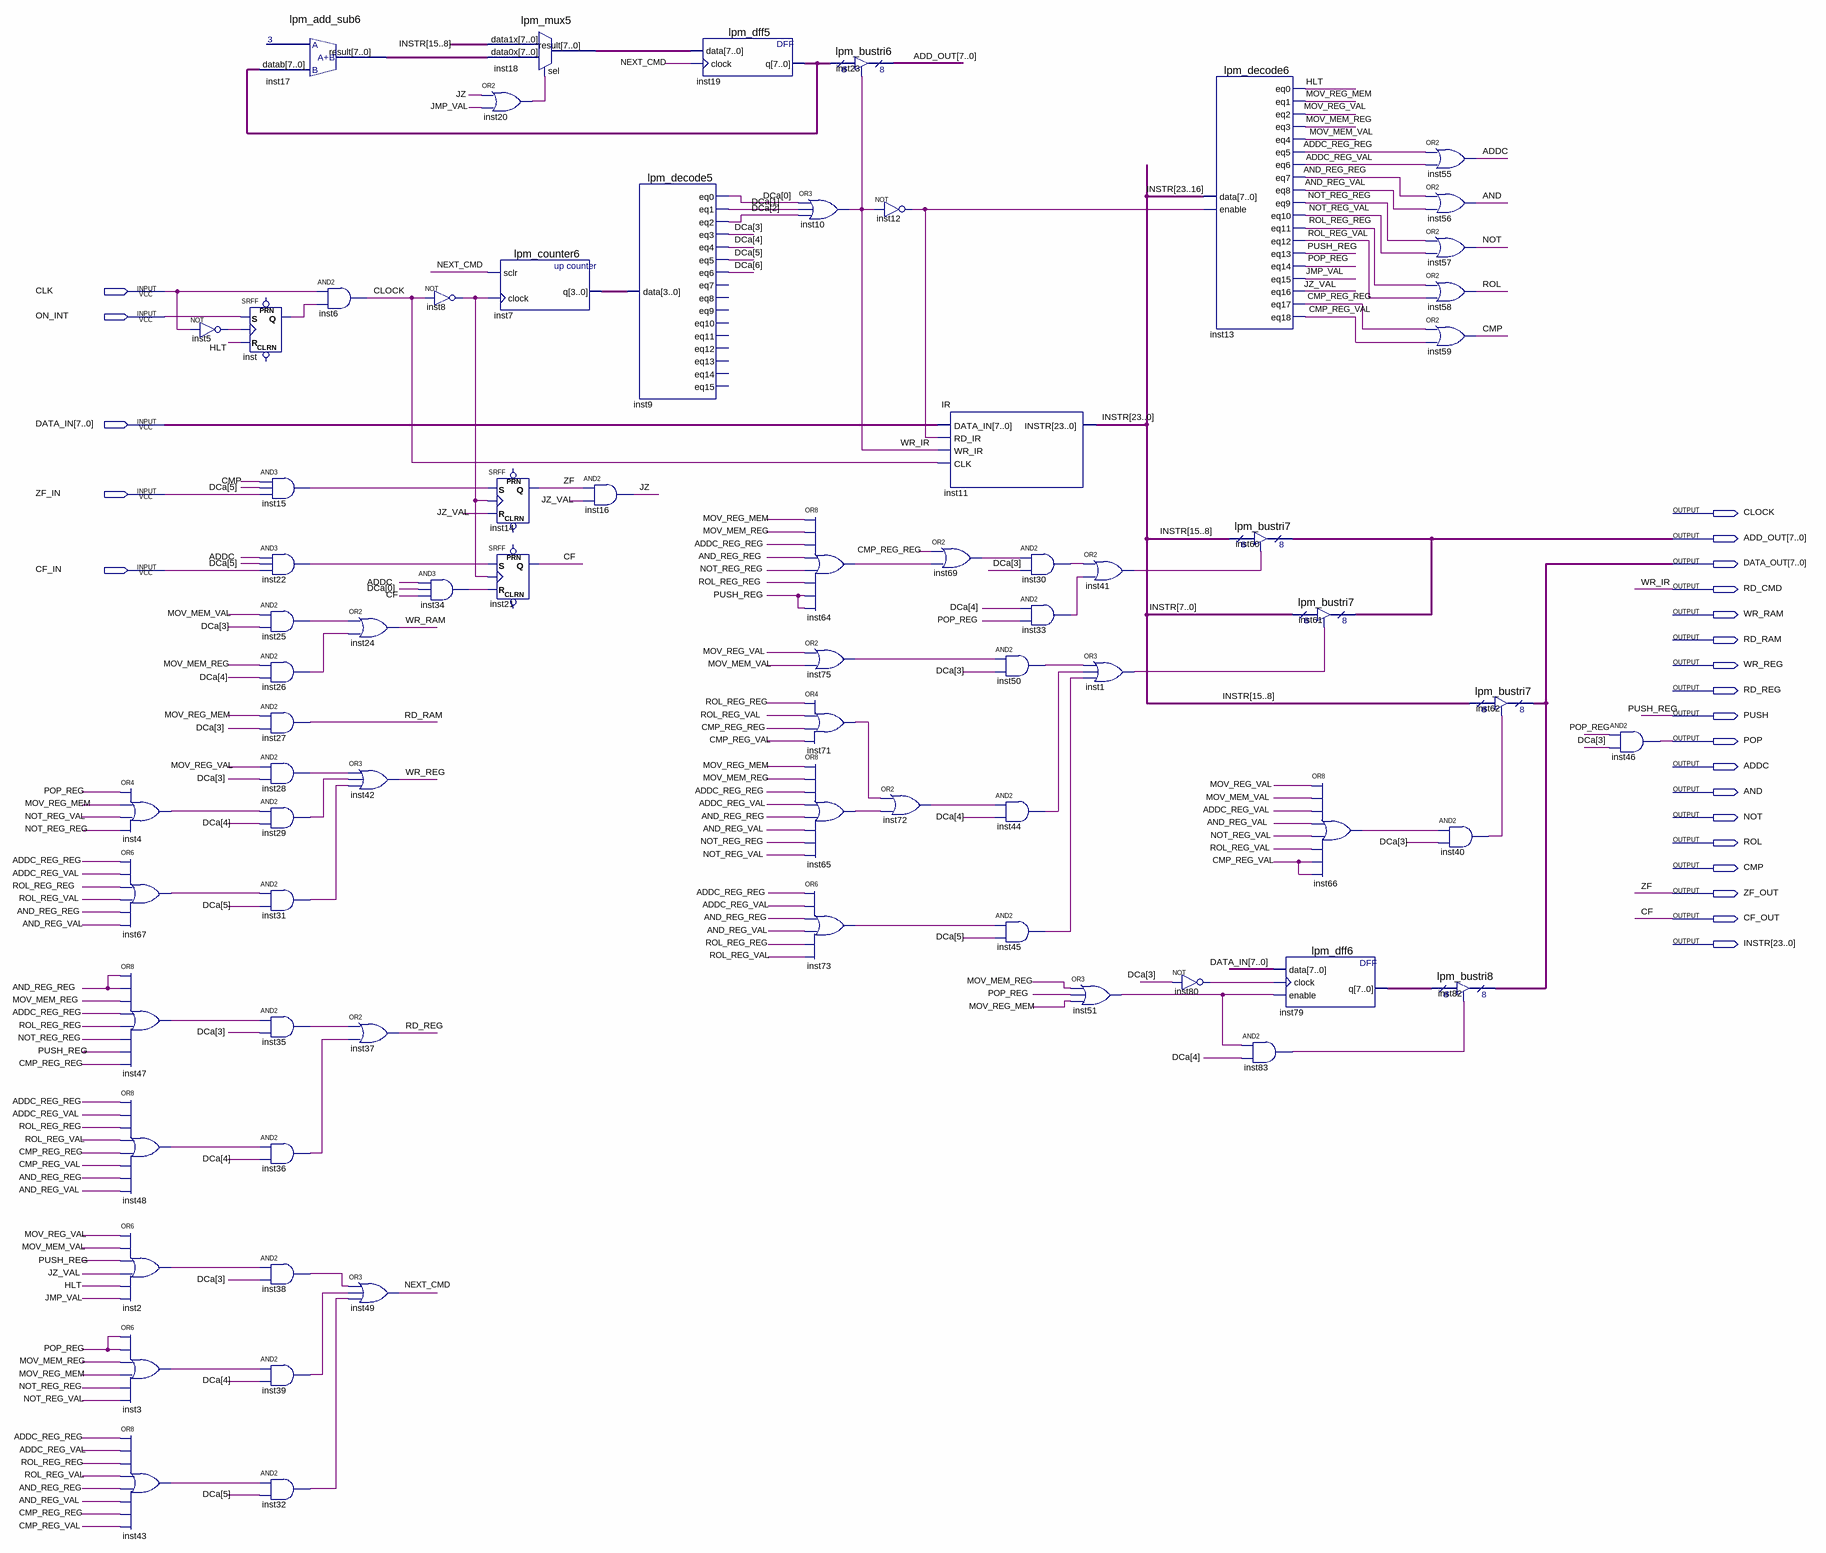
[diagram p0: schematic sheet]
// Quartus schematic CU.bdf as structural Verilog: 73 symbols, 23 pins
module CU (
  input  CLK,
  input  ON_INT,
  input  [7:0] DATA_IN,
  input  ZF_IN,
  input  CF_IN,
  output CLOCK,
  output [7:0] ADD_OUT,
  output [7:0] DATA_OUT,
  output RD_CMD,
  output WR_RAM,
  output RD_RAM,
  output WR_REG,
  output RD_REG,
  output PUSH,
  output POP,
  output ADDC,
  output AND,
  output NOT,
  output ROL,
  output CMP,
  output ZF_OUT,
  output CF_OUT,
  output [23:0] INSTR
);

  wire ADDC_REG_REG, ADDC_REG_VAL, AND_REG_REG, AND_REG_VAL, CMP_REG_REG, CMP_REG_VAL, HLT, inst1_out,
       inst2_out, inst3_out, inst4_out, inst5_out, inst8_out, inst12_out, inst15_out, inst20_out, inst22_out,
       inst25_out, inst26_out, inst28_out, inst29_out, inst30_out, inst31_out, inst32_out, inst33_out,
       inst34_out, inst35_out, inst36_out, inst38_out, inst39_out, inst40_out, inst41_out, inst43_out,
       inst44_out, inst45_out, inst47_out, inst48_out, inst50_out, inst51_out, inst64_out, inst65_out,
       inst66_out, inst67_out, inst69_out, inst71_out, inst72_out, inst73_out, inst75_out, inst80_out,
       inst83_out, inst_q, JMP_VAL, JZ, JZ_VAL, MOV_MEM_REG, MOV_MEM_VAL, MOV_REG_MEM, MOV_REG_VAL, NEXT_CMD,
       NOT_REG_REG, NOT_REG_VAL, POP_REG, ROL_REG_REG, ROL_REG_VAL;
  wire [3:0] inst7_q;
  wire [6:0] DCa;
  wire [7:0] inst17_result, inst18_result, inst19_q, inst79_q;

  or inst4 (inst4_out, POP_REG, MOV_REG_MEM, NOT_REG_VAL, NOT_REG_REG);
  or inst67 (inst67_out, ADDC_REG_REG, ADDC_REG_VAL, ROL_REG_REG, ROL_REG_VAL, AND_REG_REG, AND_REG_VAL);
  or inst47 (inst47_out, AND_REG_REG, AND_REG_REG, MOV_MEM_REG, ADDC_REG_REG, ROL_REG_REG, NOT_REG_REG, PUSH, CMP_REG_REG);
  or inst48 (inst48_out, ADDC_REG_REG, ADDC_REG_VAL, ROL_REG_REG, ROL_REG_VAL, CMP_REG_REG, CMP_REG_VAL, AND_REG_REG, AND_REG_VAL);
  or inst2 (inst2_out, MOV_REG_VAL, MOV_MEM_VAL, PUSH, JZ_VAL, HLT, JMP_VAL);
  or inst3 (inst3_out, POP_REG, POP_REG, MOV_MEM_REG, MOV_REG_MEM, NOT_REG_REG, NOT_REG_VAL);
  or inst43 (inst43_out, ADDC_REG_REG, ADDC_REG_VAL, ROL_REG_REG, ROL_REG_VAL, AND_REG_REG, AND_REG_VAL, CMP_REG_REG, CMP_REG_VAL);
  not inst5 (inst5_out, CLK);
  SRFF inst (.S(ON_INT), .R(HLT), .CLK(inst5_out), .Q(inst_q));  // open: PRN, CLRN
  lpm_add_sub6 inst17 (.datab(inst19_q), .result(inst17_result));
  and inst15 (inst15_out, CMP, DCa[5], ZF_IN);
  and inst22 (inst22_out, ADDC, DCa[5], CF_IN);
  and inst25 (inst25_out, MOV_MEM_VAL, DCa[3]);
  and inst26 (inst26_out, MOV_MEM_REG, DCa[4]);
  and inst27 (RD_RAM, MOV_REG_MEM, DCa[3]);
  and inst28 (inst28_out, MOV_REG_VAL, DCa[3]);
  and inst29 (inst29_out, inst4_out, DCa[4]);
  and inst31 (inst31_out, inst67_out, DCa[5]);
  and inst35 (inst35_out, inst47_out, DCa[3]);
  and inst36 (inst36_out, inst48_out, DCa[4]);
  and inst38 (inst38_out, inst2_out, DCa[3]);
  and inst39 (inst39_out, inst3_out, DCa[4]);
  and inst32 (inst32_out, inst43_out, DCa[5]);
  and inst6 (CLOCK, CLK, inst_q);
  or inst24 (WR_RAM, inst25_out, inst26_out);
  or inst42 (WR_REG, inst28_out, inst29_out, inst31_out);
  or inst37 (RD_REG, inst35_out, inst36_out);
  or inst49 (NEXT_CMD, inst38_out, inst39_out, inst32_out);
  not inst8 (inst8_out, CLOCK);
  and inst34 (inst34_out, ADDC, DCa[0], CF_OUT);
  lpm_mux5 inst18 (.data1x(INSTR[15:8]), .data0x(inst17_result), .sel(inst20_out), .result(inst18_result));
  or inst20 (inst20_out, JZ, JMP_VAL);
  lpm_counter6 inst7 (.sclr(NEXT_CMD), .clock(inst8_out), .q(inst7_q));
  SRFF inst14 (.S(inst15_out), .R(JZ_VAL), .CLK(inst8_out), .Q(ZF_OUT));  // open: PRN, CLRN
  SRFF inst21 (.S(inst22_out), .R(inst34_out), .CLK(inst8_out), .Q(CF_OUT));  // open: PRN, CLRN
  and inst16 (JZ, ZF_OUT, JZ_VAL);
  lpm_decode5 inst9 (
    .data(inst7_q), .eq0(DCa[0]), .eq1(DCa[1]), .eq2(DCa[2]), .eq3(DCa[3]), .eq4(DCa[4]), .eq5(DCa[5]),
    .eq6(DCa[6]));  // open: eq7, eq8, eq9, eq10, eq11, eq12, eq13, eq14, eq15
  lpm_dff5 inst19 (.data(inst18_result), .clock(NEXT_CMD), .q(inst19_q));
  or inst10 (RD_CMD, DCa[0], DCa[1], DCa[2]);
  lpm_bustri6 inst23 (.enabledt(RD_CMD), .data(inst19_q), .tridata(ADD_OUT));
  or inst64 (inst64_out, MOV_REG_MEM, MOV_MEM_REG, ADDC_REG_REG, AND_REG_REG, NOT_REG_REG, ROL_REG_REG, PUSH, PUSH);
  or inst75 (inst75_out, MOV_REG_VAL, MOV_MEM_VAL);
  or inst71 (inst71_out, ROL_REG_REG, ROL_REG_VAL, CMP_REG_REG, CMP_REG_VAL);
  or inst65 (inst65_out, MOV_REG_MEM, MOV_MEM_REG, ADDC_REG_REG, ADDC_REG_VAL, AND_REG_REG, AND_REG_VAL, NOT_REG_REG, NOT_REG_VAL);
  or inst73 (inst73_out, ADDC_REG_REG, ADDC_REG_VAL, AND_REG_REG, AND_REG_VAL, ROL_REG_REG, ROL_REG_VAL);
  not inst12 (inst12_out, RD_CMD);
  or inst72 (inst72_out, inst71_out, inst65_out);
  IR inst11 (.DATA_IN(DATA_IN), .RD_IR(inst12_out), .WR_IR(RD_CMD), .CLK(CLOCK), .INSTR(INSTR));
  or inst69 (inst69_out, CMP_REG_REG, inst64_out);
  and inst50 (inst50_out, inst75_out, DCa[3]);
  and inst44 (inst44_out, inst72_out, DCa[4]);
  and inst45 (inst45_out, inst73_out, DCa[5]);
  and inst30 (inst30_out, inst69_out, DCa[3]);
  and inst33 (inst33_out, DCa[4], POP_REG);
  or inst41 (inst41_out, inst30_out, inst33_out);
  or inst1 (inst1_out, inst50_out, inst44_out, inst45_out);
  or inst51 (inst51_out, MOV_MEM_REG, POP_REG, MOV_REG_MEM);
  lpm_decode6 inst13 (
    .data(INSTR[23:16]), .enable(inst12_out), .eq0(HLT), .eq1(MOV_REG_MEM), .eq2(MOV_REG_VAL),
    .eq3(MOV_MEM_REG), .eq4(MOV_MEM_VAL), .eq5(ADDC_REG_REG), .eq6(ADDC_REG_VAL), .eq7(AND_REG_REG),
    .eq8(AND_REG_VAL), .eq9(NOT_REG_REG), .eq10(NOT_REG_VAL), .eq11(ROL_REG_REG), .eq12(ROL_REG_VAL),
    .eq13(PUSH), .eq14(POP_REG), .eq15(JMP_VAL), .eq16(JZ_VAL), .eq17(CMP_REG_REG), .eq18(CMP_REG_VAL));
  not inst80 (inst80_out, DCa[3]);
  lpm_bustri7 inst60 (.enabledt(inst41_out), .data(INSTR[15:8]), .tridata(ADD_OUT));
  and inst83 (inst83_out, inst51_out, DCa[4]);
  lpm_bustri7 inst61 (.enabledt(inst1_out), .data(INSTR[7:0]), .tridata(ADD_OUT));
  lpm_dff6 inst79 (.data(DATA_IN), .clock(inst80_out), .enable(inst51_out), .q(inst79_q));
  or inst66 (inst66_out, MOV_REG_VAL, MOV_MEM_VAL, ADDC_REG_VAL, AND_REG_VAL, NOT_REG_VAL, ROL_REG_VAL, CMP_REG_VAL, CMP_REG_VAL);
  or inst55 (ADDC, ADDC_REG_REG, ADDC_REG_VAL);
  or inst56 (AND, AND_REG_REG, AND_REG_VAL);
  or inst57 (NOT, NOT_REG_REG, NOT_REG_VAL);
  or inst58 (ROL, ROL_REG_REG, ROL_REG_VAL);
  or inst59 (CMP, CMP_REG_REG, CMP_REG_VAL);
  and inst40 (inst40_out, inst66_out, DCa[3]);
  lpm_bustri8 inst82 (.enabledt(inst83_out), .data(inst79_q), .tridata(DATA_OUT));
  lpm_bustri7 inst62 (.enabledt(inst40_out), .data(INSTR[15:8]), .tridata(DATA_OUT));
  and inst46 (POP, POP_REG, DCa[3]);

  // Other names for the same wires on the sheet: CF = CF_OUT; PUSH_REG = PUSH; WR_IR = RD_CMD; ZF = ZF_OUT
endmodule
